# Altium project SensTPR.PrjPCB
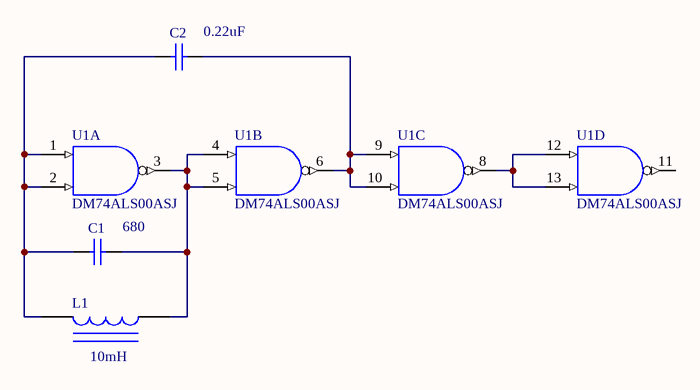
[diagram p0: SensTPR.SchDoc]
1 sheet, 4 parts. Net scope: global (net labels, ports and power ports of the same name join across sheets).
Board file: SensTPR.PcbDoc

## Sheet SensTPR.SchDoc
size A4

### Parts
C1  value 680  [RAD-0.3]  (hidden comment: Cap)
C2  value 0.22uF  [RAD-0.3]  (hidden comment: Cap)
L1  value 10mH  [AXIAL-0.9]  (hidden comment: Inductor Iron)
U1  DM74ALS00ASJ  [M14D_N]  (parts A,B,C,D of 4)

### Nets
GND: U1.7(GND)
VCC: U1.14(VCC)
NetC1_1: C1.1 L1.1 U1.3(Y) U1.4(A) U1.5(B)
NetC1_2: C1.2 C2.2 L1.2 U1.1(A) U1.2(B)
NetC2_1: C2.1 U1.6(Y) U1.9(A) U1.10(B)
NetU1_8: U1.8(Y) U1.12(A) U1.13(B)

Not connected (* = marked no-connect by the designer): U1 11(Y)

### Library data of the parts
C1 C2 = Cap: Capacitor; Published: 8-Jun-2000; LatestRevisionDate: 17-Jul-2002; LatestRevisionNote: Re-released for DXP Platform.; PackageReference: RAD-0.3; Publisher: Altium Limited; PackageDescription: Radial Cap, Thru-Hole; 2 Leads; 0.3 in Pin Spacing
L1 = Inductor Iron: Magnetic-Core Inductor; Published: 24-Mar-1999; LatestRevisionDate: 17-Jul-2002; LatestRevisionNote: Re-released for DXP Platform.; PackageReference: AXIAL-0.9; Publisher: Altium Limited; PackageDescription: Axial Device, Thru-Hole; 2 Leads; 0.9 in Pin Spacing
U1 = DM74ALS00ASJ: Quad 2-Input NAND Gate, 14-Pin SOP, Commerical Grade; IC_Technology: ALS; Published: 17-Jul-2002; LatestRevisionDate: 13-Apr-2006; LatestRevisionNote: IPC-7351 Footprint Added.; DatasheetVersion: Feb-1998; PackageVersion: 2000; PackageReference: M14D; Publisher: Altium Limited; PackageDescription: 14-Pin Small Outline Package 1.27 mm Pitch; ComponentLink1Description: Manufacturer Link; ComponentLink1URL: http://www.fairchildsemi.com/; ComponentLink2Description: Datasheet; ComponentLink2URL: http://www.fairchildsemi.com/ds/DM%2FDM74ALS00A.pdf